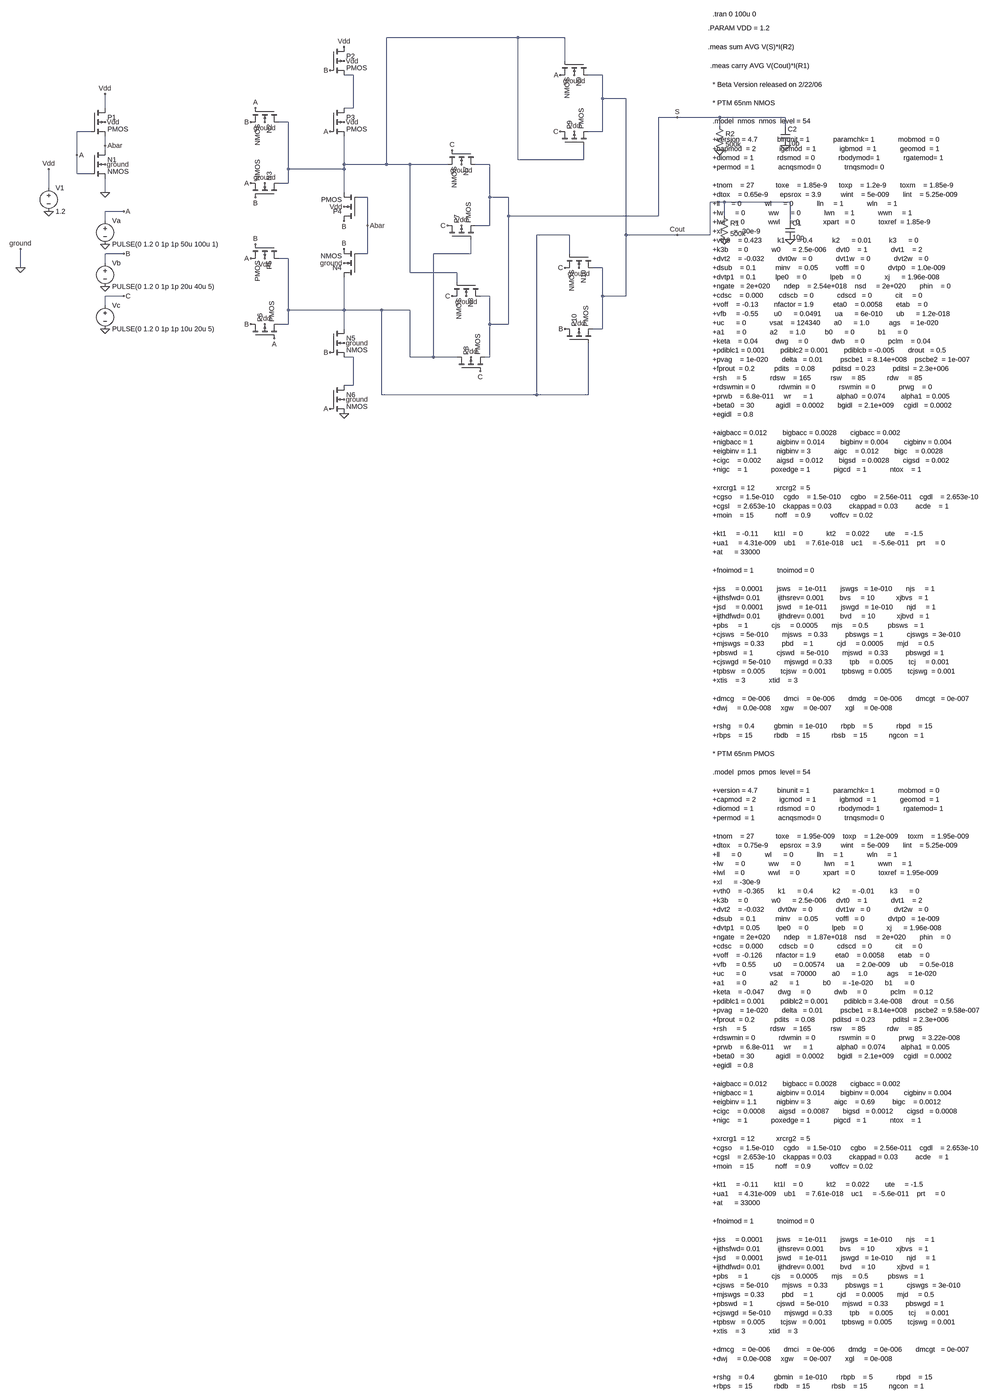
[diagram p0: schematic delay_pr.asc, whole sheet]
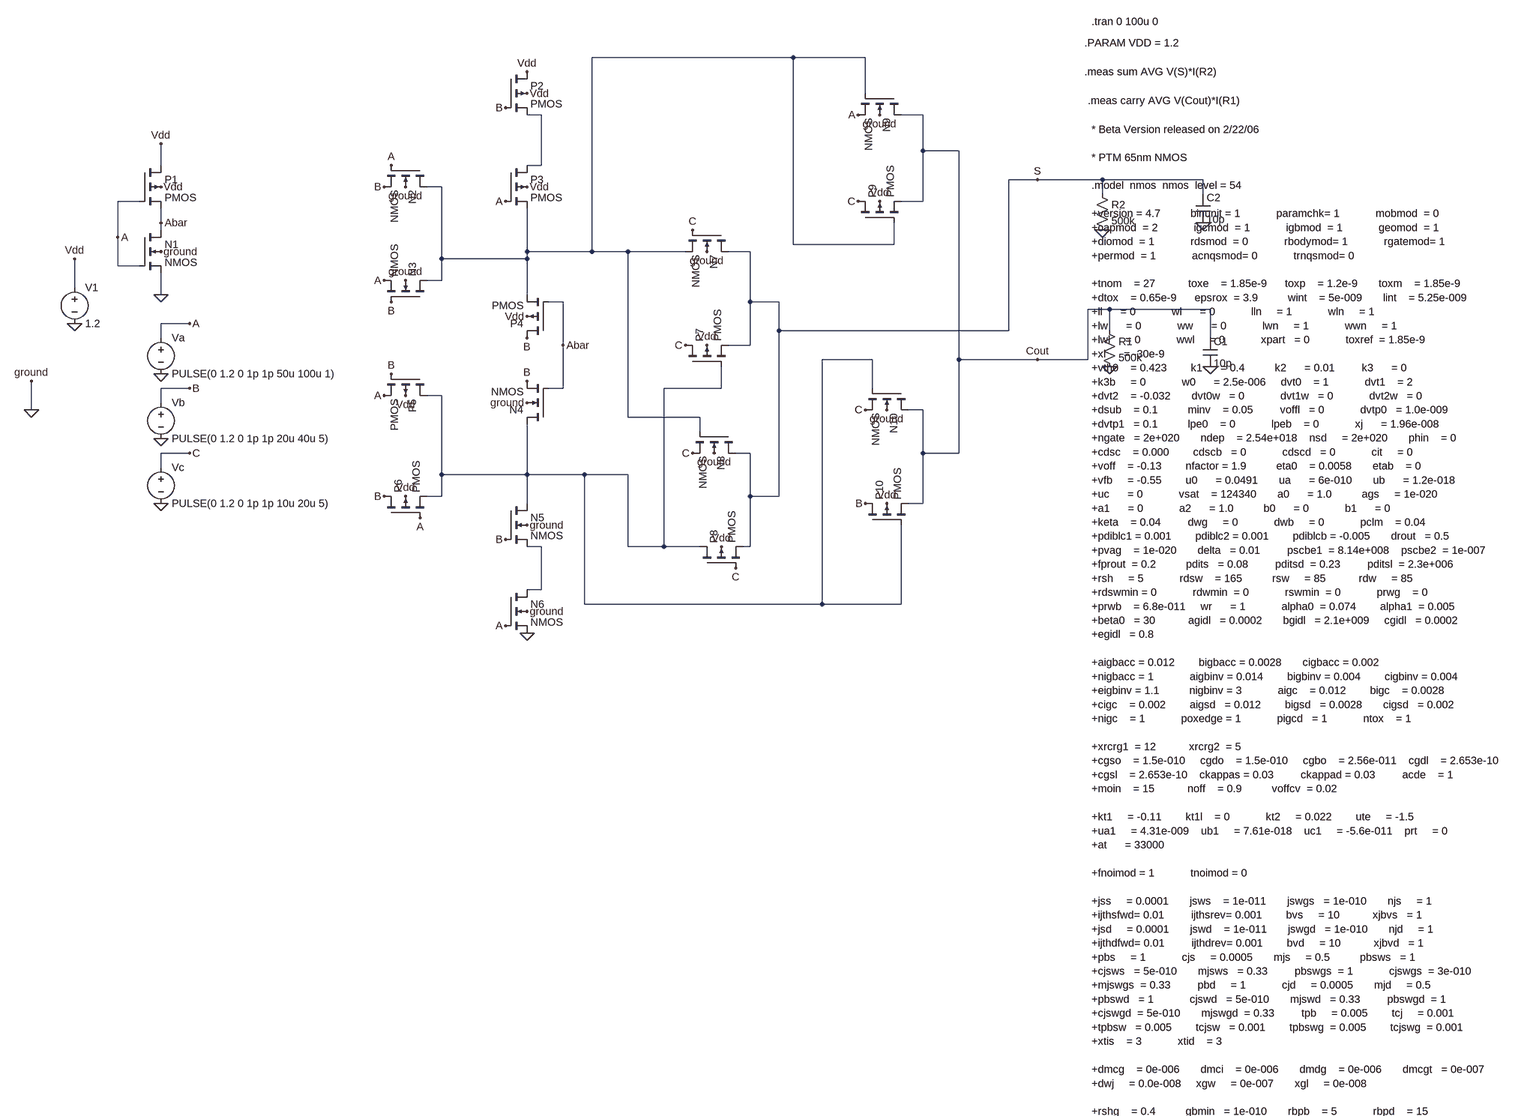
[diagram p1: schematic delay_pr.asc, part, row 1 of 2, column 1 of 1]
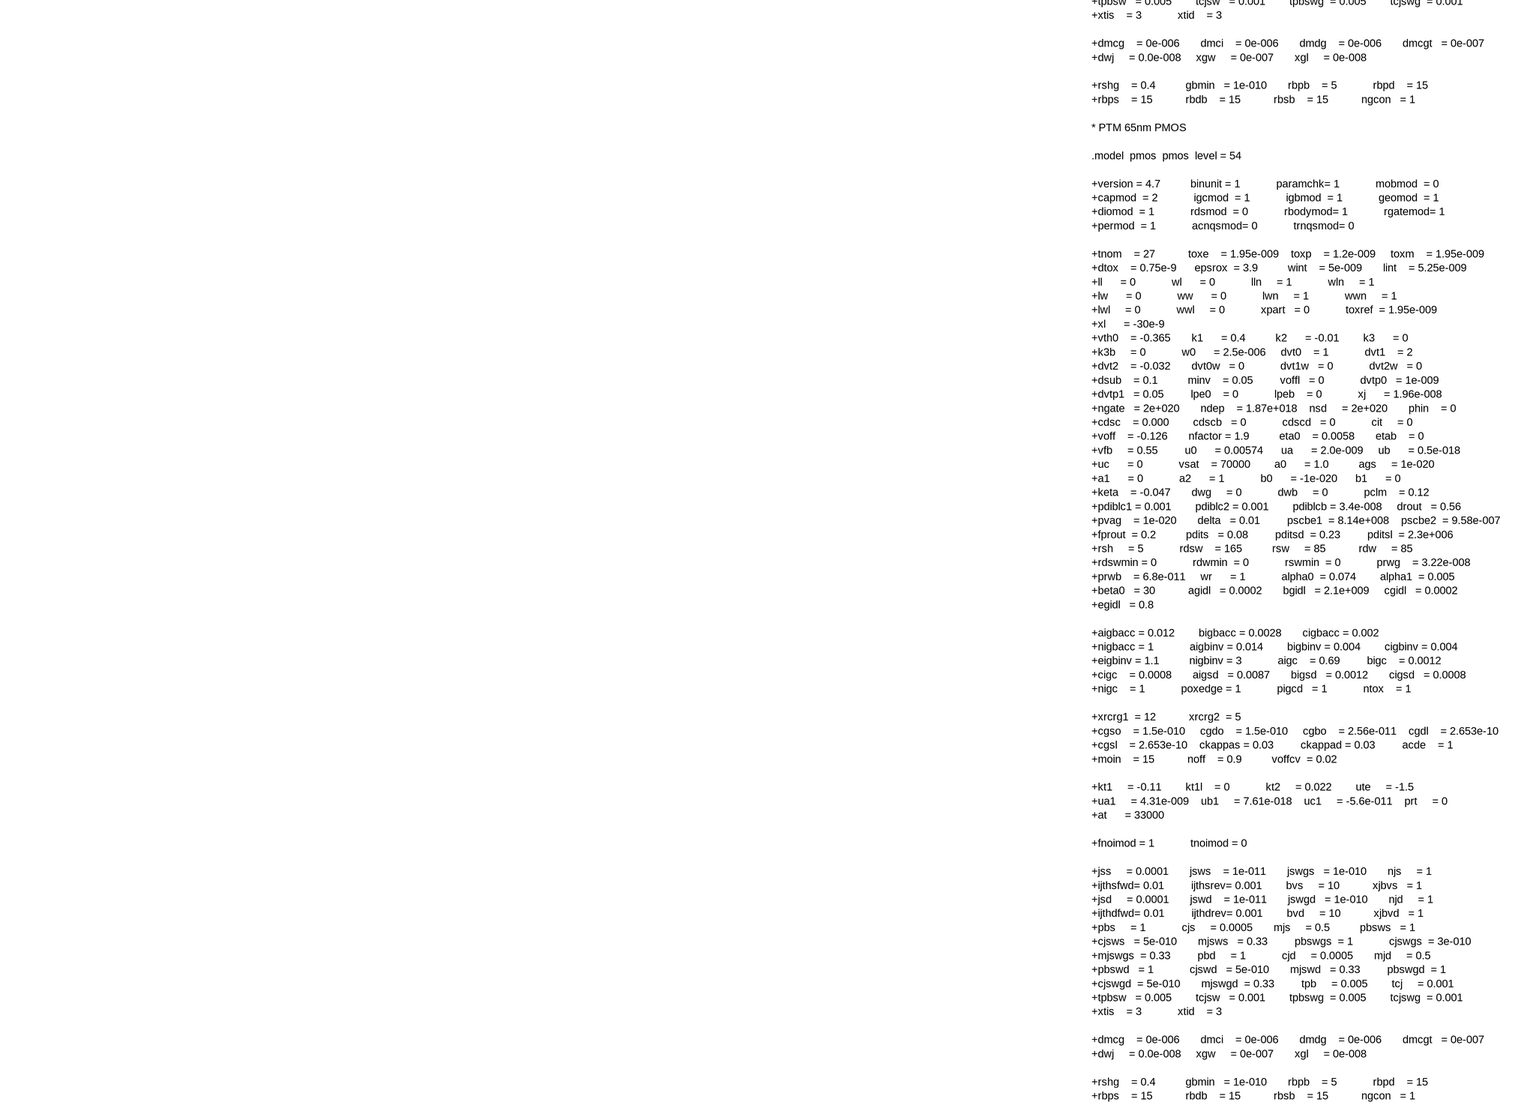
[diagram p2: schematic delay_pr.asc, part, row 2 of 2, column 1 of 1]
delay_pr.asc, the LTspice schematic file:
Version 4
SHEET 1 3516 3736
WIRE 1792 -416 1344 -416
WIRE 1952 -416 1792 -416
WIRE 1952 -336 1952 -416
WIRE 1232 -288 1200 -288
WIRE 2080 -288 2032 -288
WIRE 2080 -208 2080 -288
WIRE 2160 -208 2080 -208
WIRE 336 -176 336 -224
WIRE 1232 -176 1232 -288
WIRE 1232 -176 1200 -176
WIRE 2400 -144 2336 -144
WIRE 2544 -144 2400 -144
WIRE 2768 -144 2544 -144
WIRE 960 -128 928 -128
WIRE 2544 -112 2544 -144
WIRE 2768 -112 2768 -144
WIRE 288 -96 240 -96
WIRE 2080 -96 2080 -208
WIRE 2080 -96 2032 -96
WIRE 336 -48 336 -80
WIRE 336 -32 336 -48
WIRE 240 -16 240 -96
WIRE 1792 0 1792 -416
WIRE 2016 0 2016 -48
WIRE 2016 0 1792 0
WIRE 1200 16 1200 -80
WIRE 1344 16 1344 -416
WIRE 1344 16 1200 16
WIRE 1424 16 1344 16
WIRE 1552 16 1424 16
WIRE 1696 16 1648 16
WIRE 960 32 960 -128
WIRE 1200 32 1200 16
WIRE 1200 32 960 32
WIRE 240 48 240 -16
WIRE 288 48 240 48
WIRE 960 80 960 32
WIRE 960 80 928 80
WIRE 144 96 144 32
WIRE 336 112 336 64
WIRE 1200 112 1200 32
WIRE 1280 128 1248 128
WIRE 1696 128 1696 16
WIRE 1760 128 1696 128
WIRE 2560 144 2512 144
WIRE 2784 144 2560 144
WIRE 400 176 336 176
WIRE 1760 192 1760 128
WIRE 2336 192 2336 -144
WIRE 2336 192 1760 192
WIRE 2560 192 2560 144
WIRE 336 208 336 176
WIRE 2784 208 2784 144
WIRE 1280 224 1280 128
WIRE 1696 224 1696 128
WIRE 1696 224 1648 224
WIRE 1968 256 1856 256
WIRE 2160 256 2160 -208
WIRE 2400 256 2160 256
WIRE 2512 256 2512 144
WIRE 2512 256 2400 256
WIRE 400 320 336 320
WIRE 1280 320 1280 224
WIRE 1280 320 1248 320
WIRE 1632 320 1632 272
WIRE 1632 320 1504 320
WIRE 1968 320 1968 256
WIRE 960 336 928 336
WIRE 336 352 336 320
WIRE 48 368 48 304
WIRE 2080 368 2048 368
WIRE 1424 384 1424 16
WIRE 1584 384 1424 384
WIRE 1584 416 1584 384
WIRE 400 464 336 464
WIRE 1696 464 1664 464
WIRE 2080 464 2080 368
WIRE 2160 464 2160 256
WIRE 2160 464 2080 464
WIRE 336 496 336 464
WIRE 960 512 960 336
WIRE 1200 512 1200 400
WIRE 1200 512 960 512
WIRE 1328 512 1200 512
WIRE 1424 512 1328 512
WIRE 960 560 960 512
WIRE 960 560 928 560
WIRE 1696 560 1696 464
WIRE 1760 560 1760 192
WIRE 1760 560 1696 560
WIRE 1200 576 1200 512
WIRE 2080 576 2080 464
WIRE 2080 576 2048 576
WIRE 1232 672 1200 672
WIRE 1424 672 1424 512
WIRE 1504 672 1504 320
WIRE 1504 672 1424 672
WIRE 1584 672 1504 672
WIRE 1696 672 1696 560
WIRE 1696 672 1680 672
WIRE 1232 768 1232 672
WIRE 1232 768 1200 768
WIRE 1328 800 1328 512
WIRE 1856 800 1856 256
WIRE 1856 800 1328 800
WIRE 2032 800 2032 624
WIRE 2032 800 1856 800
FLAG 144 176 0
FLAG 48 368 0
FLAG 336 288 0
FLAG 336 432 0
FLAG 336 576 0
FLAG 336 112 0
FLAG 144 32 Vdd
FLAG 48 304 ground
FLAG 400 176 A
FLAG 240 -16 A
FLAG 336 -224 Vdd
FLAG 336 -128 Vdd
FLAG 336 16 ground
FLAG 400 320 B
FLAG 400 464 C
FLAG 336 -48 Abar
FLAG 848 -176 A
FLAG 832 80 A
FLAG 832 336 A
FLAG 912 608 A
FLAG 1152 -96 A
FLAG 1152 848 A
FLAG 1936 -288 A
FLAG 880 -128 ground
FLAG 880 80 ground
FLAG 1200 352 ground
FLAG 1200 624 ground
FLAG 1200 816 ground
FLAG 1600 16 ground
FLAG 1616 464 ground
FLAG 1984 -288 ground
FLAG 2000 368 ground
FLAG 832 -128 B
FLAG 848 128 B
FLAG 848 288 B
FLAG 832 560 B
FLAG 1152 -304 B
FLAG 1200 208 B
FLAG 1200 304 B
FLAG 1152 656 B
FLAG 1952 576 B
FLAG 880 336 Vdd
FLAG 880 560 Vdd
FLAG 1200 -336 Vdd
FLAG 1200 -128 Vdd
FLAG 1200 160 Vdd
FLAG 1600 224 Vdd
FLAG 1632 672 Vdd
FLAG 1984 -96 Vdd
FLAG 2000 576 Vdd
FLAG 1568 -32 C
FLAG 1552 224 C
FLAG 1568 464 C
FLAG 1664 720 C
FLAG 1936 -96 C
FLAG 1952 368 C
FLAG 1280 224 Abar
FLAG 1200 -384 Vdd
FLAG 2544 -32 0
FLAG 2768 -48 0
FLAG 2560 272 0
FLAG 2784 272 0
FLAG 2400 -144 S
FLAG 2400 256 Cout
FLAG 1200 864 0
SYMBOL voltage 144 80 R0
WINDOW 123 0 0 Left 0
WINDOW 39 0 0 Left 0
SYMATTR InstName V1
SYMATTR Value 1.2
SYMBOL voltage 336 192 R0
WINDOW 123 0 0 Left 0
WINDOW 39 0 0 Left 0
SYMATTR InstName Va
SYMATTR Value PULSE(0 1.2 0 1p 1p 50u 100u 1)
SYMBOL voltage 336 336 R0
WINDOW 123 0 0 Left 0
WINDOW 39 0 0 Left 0
SYMATTR InstName Vb
SYMATTR Value PULSE(0 1.2 0 1p 1p 20u 40u 5)
SYMBOL voltage 336 480 R0
WINDOW 123 0 0 Left 0
WINDOW 39 0 0 Left 0
SYMATTR InstName Vc
SYMATTR Value PULSE(0 1.2 0 1p 1p 10u 20u 5)
SYMBOL pmos4 288 -176 R0
SYMATTR InstName P1
SYMATTR Value2 l=65nm w=547pm
SYMBOL nmos4 288 -32 R0
SYMATTR InstName N1
SYMBOL nmos4 928 -176 R90
SYMATTR InstName N2
SYMBOL nmos4 928 128 M270
SYMATTR InstName N3
SYMBOL nmos4 1248 400 R180
SYMATTR InstName N4
SYMBOL nmos4 1152 576 R0
SYMATTR InstName N5
SYMBOL nmos4 1152 768 R0
SYMATTR InstName N6
SYMBOL nmos4 1648 -32 R90
SYMATTR InstName N7
SYMBOL nmos4 1664 416 R90
SYMATTR InstName N8
SYMBOL nmos4 2032 -336 R90
SYMATTR InstName N9
SYMBOL nmos4 2048 320 R90
SYMATTR InstName N10
SYMBOL pmos4 928 288 R90
SYMATTR InstName P5
SYMBOL pmos4 832 608 R270
SYMATTR InstName P6
SYMBOL pmos4 1152 -384 R0
SYMATTR InstName P2
SYMBOL pmos4 1152 -176 R0
SYMATTR InstName P3
SYMBOL pmos4 1248 208 R180
SYMATTR InstName P4
SYMBOL pmos4 1552 272 R270
SYMATTR InstName P7
SYMBOL pmos4 1584 720 R270
SYMATTR InstName P8
SYMBOL pmos4 1936 -48 R270
SYMATTR InstName P9
SYMBOL pmos4 1952 624 R270
SYMATTR InstName P10
SYMBOL cap 2752 -112 R0
SYMATTR InstName C2
SYMATTR Value 10p
SYMBOL cap 2768 208 R0
SYMATTR InstName C1
SYMATTR Value 10p
SYMBOL res 2528 -128 R0
SYMATTR InstName R2
SYMATTR Value 500k
SYMBOL res 2544 176 R0
SYMATTR InstName R1
SYMATTR Value 500k
TEXT 2504 -448 Left 2 !.PARAM VDD = 1.2
TEXT 2504 -384 Left 2 !.meas sum AVG V(S)*I(R2)
TEXT 2512 -320 Left 2 !.meas carry AVG V(Cout)*I(R1)
TEXT 2520 -256 Left 2 !* Beta Version released on 2/22/06\n \n* PTM 65nm NMOS\n \n.model  nmos  nmos  level = 54\n \n+version = 4.7          binunit = 1            paramchk= 1            mobmod  = 0\n+capmod  = 2            igcmod  = 1            igbmod  = 1            geomod  = 1\n+diomod  = 1            rdsmod  = 0            rbodymod= 1            rgatemod= 1\n+permod  = 1            acnqsmod= 0            trnqsmod= 0\n \n+tnom    = 27           toxe    = 1.85e-9      toxp    = 1.2e-9       toxm    = 1.85e-9\n+dtox    = 0.65e-9      epsrox  = 3.9          wint    = 5e-009       lint    = 5.25e-009\n+ll      = 0            wl      = 0            lln     = 1            wln     = 1\n+lw      = 0            ww      = 0            lwn     = 1            wwn     = 1\n+lwl     = 0            wwl     = 0            xpart   = 0            toxref  = 1.85e-9\n+xl      = -30e-9\n+vth0    = 0.423        k1      = 0.4          k2      = 0.01         k3      = 0\n+k3b     = 0            w0      = 2.5e-006     dvt0    = 1            dvt1    = 2\n+dvt2    = -0.032       dvt0w   = 0            dvt1w   = 0            dvt2w   = 0\n+dsub    = 0.1          minv    = 0.05         voffl   = 0            dvtp0   = 1.0e-009\n+dvtp1   = 0.1          lpe0    = 0            lpeb    = 0            xj      = 1.96e-008\n+ngate   = 2e+020       ndep    = 2.54e+018    nsd     = 2e+020       phin    = 0\n+cdsc    = 0.000        cdscb   = 0            cdscd   = 0            cit     = 0\n+voff    = -0.13        nfactor = 1.9          eta0    = 0.0058       etab    = 0\n+vfb     = -0.55        u0      = 0.0491       ua      = 6e-010       ub      = 1.2e-018\n+uc      = 0            vsat    = 124340       a0      = 1.0          ags     = 1e-020\n+a1      = 0            a2      = 1.0          b0      = 0            b1      = 0\n+keta    = 0.04         dwg     = 0            dwb     = 0            pclm    = 0.04\n+pdiblc1 = 0.001        pdiblc2 = 0.001        pdiblcb = -0.005       drout   = 0.5\n+pvag    = 1e-020       delta   = 0.01         pscbe1  = 8.14e+008    pscbe2  = 1e-007\n+fprout  = 0.2          pdits   = 0.08         pditsd  = 0.23         pditsl  = 2.3e+006\n+rsh     = 5            rdsw    = 165          rsw     = 85           rdw     = 85\n+rdswmin = 0            rdwmin  = 0            rswmin  = 0            prwg    = 0\n+prwb    = 6.8e-011     wr      = 1            alpha0  = 0.074        alpha1  = 0.005\n+beta0   = 30           agidl   = 0.0002       bgidl   = 2.1e+009     cgidl   = 0.0002\n+egidl   = 0.8\n \n+aigbacc = 0.012        bigbacc = 0.0028       cigbacc = 0.002\n+nigbacc = 1            aigbinv = 0.014        bigbinv = 0.004        cigbinv = 0.004\n+eigbinv = 1.1          nigbinv = 3            aigc    = 0.012        bigc    = 0.0028\n+cigc    = 0.002        aigsd   = 0.012        bigsd   = 0.0028       cigsd   = 0.002\n+nigc    = 1            poxedge = 1            pigcd   = 1            ntox    = 1\n \n+xrcrg1  = 12           xrcrg2  = 5\n+cgso    = 1.5e-010     cgdo    = 1.5e-010     cgbo    = 2.56e-011    cgdl    = 2.653e-10\n+cgsl    = 2.653e-10    ckappas = 0.03         ckappad = 0.03         acde    = 1\n+moin    = 15           noff    = 0.9          voffcv  = 0.02\n \n+kt1     = -0.11        kt1l    = 0            kt2     = 0.022        ute     = -1.5\n+ua1     = 4.31e-009    ub1     = 7.61e-018    uc1     = -5.6e-011    prt     = 0\n+at      = 33000\n \n+fnoimod = 1            tnoimod = 0\n \n+jss     = 0.0001       jsws    = 1e-011       jswgs   = 1e-010       njs     = 1\n+ijthsfwd= 0.01         ijthsrev= 0.001        bvs     = 10           xjbvs   = 1\n+jsd     = 0.0001       jswd    = 1e-011       jswgd   = 1e-010       njd     = 1\n+ijthdfwd= 0.01         ijthdrev= 0.001        bvd     = 10           xjbvd   = 1\n+pbs     = 1            cjs     = 0.0005       mjs     = 0.5          pbsws   = 1\n+cjsws   = 5e-010       mjsws   = 0.33         pbswgs  = 1            cjswgs  = 3e-010\n+mjswgs  = 0.33         pbd     = 1            cjd     = 0.0005       mjd     = 0.5\n+pbswd   = 1            cjswd   = 5e-010       mjswd   = 0.33         pbswgd  = 1\n+cjswgd  = 5e-010       mjswgd  = 0.33         tpb     = 0.005        tcj     = 0.001\n+tpbsw   = 0.005        tcjsw   = 0.001        tpbswg  = 0.005        tcjswg  = 0.001\n+xtis    = 3            xtid    = 3\n \n+dmcg    = 0e-006       dmci    = 0e-006       dmdg    = 0e-006       dmcgt   = 0e-007\n+dwj     = 0.0e-008     xgw     = 0e-007       xgl     = 0e-008\n \n+rshg    = 0.4          gbmin   = 1e-010       rbpb    = 5            rbpd    = 15\n+rbps    = 15           rbdb    = 15           rbsb    = 15           ngcon   = 1\n \n* PTM 65nm PMOS\n \n.model  pmos  pmos  level = 54\n \n+version = 4.7          binunit = 1            paramchk= 1            mobmod  = 0\n+capmod  = 2            igcmod  = 1            igbmod  = 1            geomod  = 1\n+diomod  = 1            rdsmod  = 0            rbodymod= 1            rgatemod= 1\n+permod  = 1            acnqsmod= 0            trnqsmod= 0\n \n+tnom    = 27           toxe    = 1.95e-009    toxp    = 1.2e-009     toxm    = 1.95e-009\n+dtox    = 0.75e-9      epsrox  = 3.9          wint    = 5e-009       lint    = 5.25e-009\n+ll      = 0            wl      = 0            lln     = 1            wln     = 1\n+lw      = 0            ww      = 0            lwn     = 1            wwn     = 1\n+lwl     = 0            wwl     = 0            xpart   = 0            toxref  = 1.95e-009\n+xl      = -30e-9\n+vth0    = -0.365       k1      = 0.4          k2      = -0.01        k3      = 0\n+k3b     = 0            w0      = 2.5e-006     dvt0    = 1            dvt1    = 2\n+dvt2    = -0.032       dvt0w   = 0            dvt1w   = 0            dvt2w   = 0\n+dsub    = 0.1          minv    = 0.05         voffl   = 0            dvtp0   = 1e-009\n+dvtp1   = 0.05         lpe0    = 0            lpeb    = 0            xj      = 1.96e-008\n+ngate   = 2e+020       ndep    = 1.87e+018    nsd     = 2e+020       phin    = 0\n+cdsc    = 0.000        cdscb   = 0            cdscd   = 0            cit     = 0\n+voff    = -0.126       nfactor = 1.9          eta0    = 0.0058       etab    = 0\n+vfb     = 0.55         u0      = 0.00574      ua      = 2.0e-009     ub      = 0.5e-018\n+uc      = 0            vsat    = 70000        a0      = 1.0          ags     = 1e-020\n+a1      = 0            a2      = 1            b0      = -1e-020      b1      = 0\n+keta    = -0.047       dwg     = 0            dwb     = 0            pclm    = 0.12\n+pdiblc1 = 0.001        pdiblc2 = 0.001        pdiblcb = 3.4e-008     drout   = 0.56\n+pvag    = 1e-020       delta   = 0.01         pscbe1  = 8.14e+008    pscbe2  = 9.58e-007\n+fprout  = 0.2          pdits   = 0.08         pditsd  = 0.23         pditsl  = 2.3e+006\n+rsh     = 5            rdsw    = 165          rsw     = 85           rdw     = 85\n+rdswmin = 0            rdwmin  = 0            rswmin  = 0            prwg    = 3.22e-008\n+prwb    = 6.8e-011     wr      = 1            alpha0  = 0.074        alpha1  = 0.005\n+beta0   = 30           agidl   = 0.0002       bgidl   = 2.1e+009     cgidl   = 0.0002\n+egidl   = 0.8\n \n+aigbacc = 0.012        bigbacc = 0.0028       cigbacc = 0.002\n+nigbacc = 1            aigbinv = 0.014        bigbinv = 0.004        cigbinv = 0.004\n+eigbinv = 1.1          nigbinv = 3            aigc    = 0.69         bigc    = 0.0012\n+cigc    = 0.0008       aigsd   = 0.0087       bigsd   = 0.0012       cigsd   = 0.0008\n+nigc    = 1            poxedge = 1            pigcd   = 1            ntox    = 1\n \n+xrcrg1  = 12           xrcrg2  = 5\n+cgso    = 1.5e-010     cgdo    = 1.5e-010     cgbo    = 2.56e-011    cgdl    = 2.653e-10\n+cgsl    = 2.653e-10    ckappas = 0.03         ckappad = 0.03         acde    = 1\n+moin    = 15           noff    = 0.9          voffcv  = 0.02\n \n+kt1     = -0.11        kt1l    = 0            kt2     = 0.022        ute     = -1.5\n+ua1     = 4.31e-009    ub1     = 7.61e-018    uc1     = -5.6e-011    prt     = 0\n+at      = 33000\n \n+fnoimod = 1            tnoimod = 0\n \n+jss     = 0.0001       jsws    = 1e-011       jswgs   = 1e-010       njs     = 1\n+ijthsfwd= 0.01         ijthsrev= 0.001        bvs     = 10           xjbvs   = 1\n+jsd     = 0.0001       jswd    = 1e-011       jswgd   = 1e-010       njd     = 1\n+ijthdfwd= 0.01         ijthdrev= 0.001        bvd     = 10           xjbvd   = 1\n+pbs     = 1            cjs     = 0.0005       mjs     = 0.5          pbsws   = 1\n+cjsws   = 5e-010       mjsws   = 0.33         pbswgs  = 1            cjswgs  = 3e-010\n+mjswgs  = 0.33         pbd     = 1            cjd     = 0.0005       mjd     = 0.5\n+pbswd   = 1            cjswd   = 5e-010       mjswd   = 0.33         pbswgd  = 1\n+cjswgd  = 5e-010       mjswgd  = 0.33         tpb     = 0.005        tcj     = 0.001\n+tpbsw   = 0.005        tcjsw   = 0.001        tpbswg  = 0.005        tcjswg  = 0.001\n+xtis    = 3            xtid    = 3\n \n+dmcg    = 0e-006       dmci    = 0e-006       dmdg    = 0e-006       dmcgt   = 0e-007\n+dwj     = 0.0e-008     xgw     = 0e-007       xgl     = 0e-008\n \n+rshg    = 0.4          gbmin   = 1e-010       rbpb    = 5            rbpd    = 15\n+rbps    = 15           rbdb    = 15           rbsb    = 15           ngcon   = 1
TEXT 2520 -496 Left 2 !.tran 0 100u 0

The netlist it stands for:
* delay_pr.asc
V1 Vdd 0 1.2
Va A 0 PULSE(0 1.2 0 1p 1p 50u 100u 1)
Vb B 0 PULSE(0 1.2 0 1p 1p 20u 40u 5)
Vc C 0 PULSE(0 1.2 0 1p 1p 10u 20u 5)
M§P1 Vdd A Abar Vdd PMOS l=65nm w=547pm
M§N1 Abar A 0 0 NMOS
M§N2 N001 A B 0 NMOS
M§N3 N001 B A 0 NMOS
M§N4 N003 Abar B 0 NMOS
M§N5 N003 B N004 0 NMOS
M§N6 N004 A 0 0 NMOS
M§N7 S C N001 0 NMOS
M§N8 S N001 C 0 NMOS
M§N9 Cout N001 A 0 NMOS
M§N10 Cout N003 C 0 NMOS
M§P5 N003 B A Vdd PMOS
M§P6 B A N003 Vdd PMOS
M§P2 Vdd B N002 Vdd PMOS
M§P3 N002 A N001 Vdd PMOS
M§P4 B Abar N001 Vdd PMOS
M§P7 C N003 S Vdd PMOS
M§P8 N003 C S Vdd PMOS
M§P9 C N001 Cout Vdd PMOS
M§P10 B N003 Cout Vdd PMOS
C2 S 0 10p
C1 Cout 0 10p
R2 S 0 500k
R1 Cout 0 500k
.model NMOS NMOS
.model PMOS PMOS
.lib standard.mos
.PARAM VDD = 1.2
.meas sum AVG V(S)*I(R2)
.meas carry AVG V(Cout)*I(R1)
* Beta Version released on 2/22/06
* PTM 65nm NMOS
.model  nmos  nmos  level = 54
+version = 4.7          binunit = 1            paramchk= 1            mobmod  = 0
+capmod  = 2            igcmod  = 1            igbmod  = 1            geomod  = 1
+diomod  = 1            rdsmod  = 0            rbodymod= 1            rgatemod= 1
+permod  = 1            acnqsmod= 0            trnqsmod= 0
+tnom    = 27           toxe    = 1.85e-9      toxp    = 1.2e-9       toxm    = 1.85e-9
+dtox    = 0.65e-9      epsrox  = 3.9          wint    = 5e-009       lint    = 5.25e-009
+ll      = 0            wl      = 0            lln     = 1            wln     = 1
+lw      = 0            ww      = 0            lwn     = 1            wwn     = 1
+lwl     = 0            wwl     = 0            xpart   = 0            toxref  = 1.85e-9
+xl      = -30e-9
+vth0    = 0.423        k1      = 0.4          k2      = 0.01         k3      = 0
+k3b     = 0            w0      = 2.5e-006     dvt0    = 1            dvt1    = 2
+dvt2    = -0.032       dvt0w   = 0            dvt1w   = 0            dvt2w   = 0
+dsub    = 0.1          minv    = 0.05         voffl   = 0            dvtp0   = 1.0e-009
+dvtp1   = 0.1          lpe0    = 0            lpeb    = 0            xj      = 1.96e-008
+ngate   = 2e+020       ndep    = 2.54e+018    nsd     = 2e+020       phin    = 0
+cdsc    = 0.000        cdscb   = 0            cdscd   = 0            cit     = 0
+voff    = -0.13        nfactor = 1.9          eta0    = 0.0058       etab    = 0
+vfb     = -0.55        u0      = 0.0491       ua      = 6e-010       ub      = 1.2e-018
+uc      = 0            vsat    = 124340       a0      = 1.0          ags     = 1e-020
+a1      = 0            a2      = 1.0          b0      = 0            b1      = 0
+keta    = 0.04         dwg     = 0            dwb     = 0            pclm    = 0.04
+pdiblc1 = 0.001        pdiblc2 = 0.001        pdiblcb = -0.005       drout   = 0.5
+pvag    = 1e-020       delta   = 0.01         pscbe1  = 8.14e+008    pscbe2  = 1e-007
+fprout  = 0.2          pdits   = 0.08         pditsd  = 0.23         pditsl  = 2.3e+006
+rsh     = 5            rdsw    = 165          rsw     = 85           rdw     = 85
+rdswmin = 0            rdwmin  = 0            rswmin  = 0            prwg    = 0
+prwb    = 6.8e-011     wr      = 1            alpha0  = 0.074        alpha1  = 0.005
+beta0   = 30           agidl   = 0.0002       bgidl   = 2.1e+009     cgidl   = 0.0002
+egidl   = 0.8
+aigbacc = 0.012        bigbacc = 0.0028       cigbacc = 0.002
+nigbacc = 1            aigbinv = 0.014        bigbinv = 0.004        cigbinv = 0.004
+eigbinv = 1.1          nigbinv = 3            aigc    = 0.012        bigc    = 0.0028
+cigc    = 0.002        aigsd   = 0.012        bigsd   = 0.0028       cigsd   = 0.002
+nigc    = 1            poxedge = 1            pigcd   = 1            ntox    = 1
+xrcrg1  = 12           xrcrg2  = 5
+cgso    = 1.5e-010     cgdo    = 1.5e-010     cgbo    = 2.56e-011    cgdl    = 2.653e-10
+cgsl    = 2.653e-10    ckappas = 0.03         ckappad = 0.03         acde    = 1
+moin    = 15           noff    = 0.9          voffcv  = 0.02
+kt1     = -0.11        kt1l    = 0            kt2     = 0.022        ute     = -1.5
+ua1     = 4.31e-009    ub1     = 7.61e-018    uc1     = -5.6e-011    prt     = 0
+at      = 33000
+fnoimod = 1            tnoimod = 0
+jss     = 0.0001       jsws    = 1e-011       jswgs   = 1e-010       njs     = 1
+ijthsfwd= 0.01         ijthsrev= 0.001        bvs     = 10           xjbvs   = 1
+jsd     = 0.0001       jswd    = 1e-011       jswgd   = 1e-010       njd     = 1
+ijthdfwd= 0.01         ijthdrev= 0.001        bvd     = 10           xjbvd   = 1
+pbs     = 1            cjs     = 0.0005       mjs     = 0.5          pbsws   = 1
+cjsws   = 5e-010       mjsws   = 0.33         pbswgs  = 1            cjswgs  = 3e-010
+mjswgs  = 0.33         pbd     = 1            cjd     = 0.0005       mjd     = 0.5
+pbswd   = 1            cjswd   = 5e-010       mjswd   = 0.33         pbswgd  = 1
+cjswgd  = 5e-010       mjswgd  = 0.33         tpb     = 0.005        tcj     = 0.001
+tpbsw   = 0.005        tcjsw   = 0.001        tpbswg  = 0.005        tcjswg  = 0.001
+xtis    = 3            xtid    = 3
+dmcg    = 0e-006       dmci    = 0e-006       dmdg    = 0e-006       dmcgt   = 0e-007
+dwj     = 0.0e-008     xgw     = 0e-007       xgl     = 0e-008
+rshg    = 0.4          gbmin   = 1e-010       rbpb    = 5            rbpd    = 15
+rbps    = 15           rbdb    = 15           rbsb    = 15           ngcon   = 1
* PTM 65nm PMOS
.model  pmos  pmos  level = 54
+version = 4.7          binunit = 1            paramchk= 1            mobmod  = 0
+capmod  = 2            igcmod  = 1            igbmod  = 1            geomod  = 1
+diomod  = 1            rdsmod  = 0            rbodymod= 1            rgatemod= 1
+permod  = 1            acnqsmod= 0            trnqsmod= 0
+tnom    = 27           toxe    = 1.95e-009    toxp    = 1.2e-009     toxm    = 1.95e-009
+dtox    = 0.75e-9      epsrox  = 3.9          wint    = 5e-009       lint    = 5.25e-009
+ll      = 0            wl      = 0            lln     = 1            wln     = 1
+lw      = 0            ww      = 0            lwn     = 1            wwn     = 1
+lwl     = 0            wwl     = 0            xpart   = 0            toxref  = 1.95e-009
+xl      = -30e-9
+vth0    = -0.365       k1      = 0.4          k2      = -0.01        k3      = 0
+k3b     = 0            w0      = 2.5e-006     dvt0    = 1            dvt1    = 2
+dvt2    = -0.032       dvt0w   = 0            dvt1w   = 0            dvt2w   = 0
+dsub    = 0.1          minv    = 0.05         voffl   = 0            dvtp0   = 1e-009
+dvtp1   = 0.05         lpe0    = 0            lpeb    = 0            xj      = 1.96e-008
+ngate   = 2e+020       ndep    = 1.87e+018    nsd     = 2e+020       phin    = 0
+cdsc    = 0.000        cdscb   = 0            cdscd   = 0            cit     = 0
+voff    = -0.126       nfactor = 1.9          eta0    = 0.0058       etab    = 0
+vfb     = 0.55         u0      = 0.00574      ua      = 2.0e-009     ub      = 0.5e-018
+uc      = 0            vsat    = 70000        a0      = 1.0          ags     = 1e-020
+a1      = 0            a2      = 1            b0      = -1e-020      b1      = 0
+keta    = -0.047       dwg     = 0            dwb     = 0            pclm    = 0.12
+pdiblc1 = 0.001        pdiblc2 = 0.001        pdiblcb = 3.4e-008     drout   = 0.56
+pvag    = 1e-020       delta   = 0.01         pscbe1  = 8.14e+008    pscbe2  = 9.58e-007
+fprout  = 0.2          pdits   = 0.08         pditsd  = 0.23         pditsl  = 2.3e+006
+rsh     = 5            rdsw    = 165          rsw     = 85           rdw     = 85
+rdswmin = 0            rdwmin  = 0            rswmin  = 0            prwg    = 3.22e-008
+prwb    = 6.8e-011     wr      = 1            alpha0  = 0.074        alpha1  = 0.005
+beta0   = 30           agidl   = 0.0002       bgidl   = 2.1e+009     cgidl   = 0.0002
+egidl   = 0.8
+aigbacc = 0.012        bigbacc = 0.0028       cigbacc = 0.002
+nigbacc = 1            aigbinv = 0.014        bigbinv = 0.004        cigbinv = 0.004
+eigbinv = 1.1          nigbinv = 3            aigc    = 0.69         bigc    = 0.0012
+cigc    = 0.0008       aigsd   = 0.0087       bigsd   = 0.0012       cigsd   = 0.0008
+nigc    = 1            poxedge = 1            pigcd   = 1            ntox    = 1
+xrcrg1  = 12           xrcrg2  = 5
+cgso    = 1.5e-010     cgdo    = 1.5e-010     cgbo    = 2.56e-011    cgdl    = 2.653e-10
+cgsl    = 2.653e-10    ckappas = 0.03         ckappad = 0.03         acde    = 1
+moin    = 15           noff    = 0.9          voffcv  = 0.02
+kt1     = -0.11        kt1l    = 0            kt2     = 0.022        ute     = -1.5
+ua1     = 4.31e-009    ub1     = 7.61e-018    uc1     = -5.6e-011    prt     = 0
+at      = 33000
+fnoimod = 1            tnoimod = 0
+jss     = 0.0001       jsws    = 1e-011       jswgs   = 1e-010       njs     = 1
+ijthsfwd= 0.01         ijthsrev= 0.001        bvs     = 10           xjbvs   = 1
+jsd     = 0.0001       jswd    = 1e-011       jswgd   = 1e-010       njd     = 1
+ijthdfwd= 0.01         ijthdrev= 0.001        bvd     = 10           xjbvd   = 1
+pbs     = 1            cjs     = 0.0005       mjs     = 0.5          pbsws   = 1
+cjsws   = 5e-010       mjsws   = 0.33         pbswgs  = 1            cjswgs  = 3e-010
+mjswgs  = 0.33         pbd     = 1            cjd     = 0.0005       mjd     = 0.5
+pbswd   = 1            cjswd   = 5e-010       mjswd   = 0.33         pbswgd  = 1
+cjswgd  = 5e-010       mjswgd  = 0.33         tpb     = 0.005        tcj     = 0.001
+tpbsw   = 0.005        tcjsw   = 0.001        tpbswg  = 0.005        tcjswg  = 0.001
+xtis    = 3            xtid    = 3
+dmcg    = 0e-006       dmci    = 0e-006       dmdg    = 0e-006       dmcgt   = 0e-007
+dwj     = 0.0e-008     xgw     = 0e-007       xgl     = 0e-008
+rshg    = 0.4          gbmin   = 1e-010       rbpb    = 5            rbpd    = 15
+rbps    = 15           rbdb    = 15           rbsb    = 15           ngcon   = 1
.tran 0 100u 0
.backanno
.end